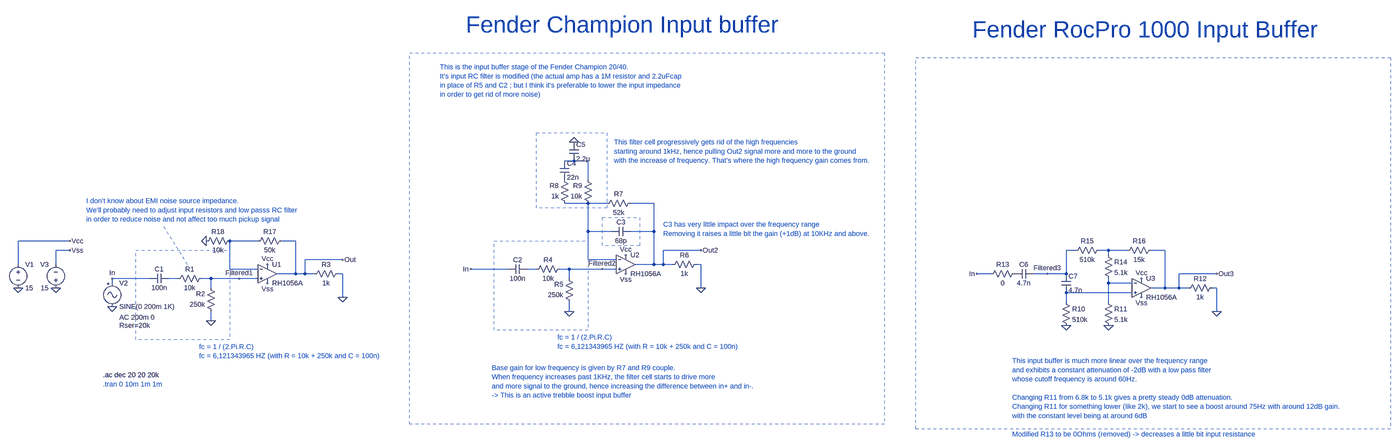
[diagram p0: schematic InputBuffer.asc, whole sheet]
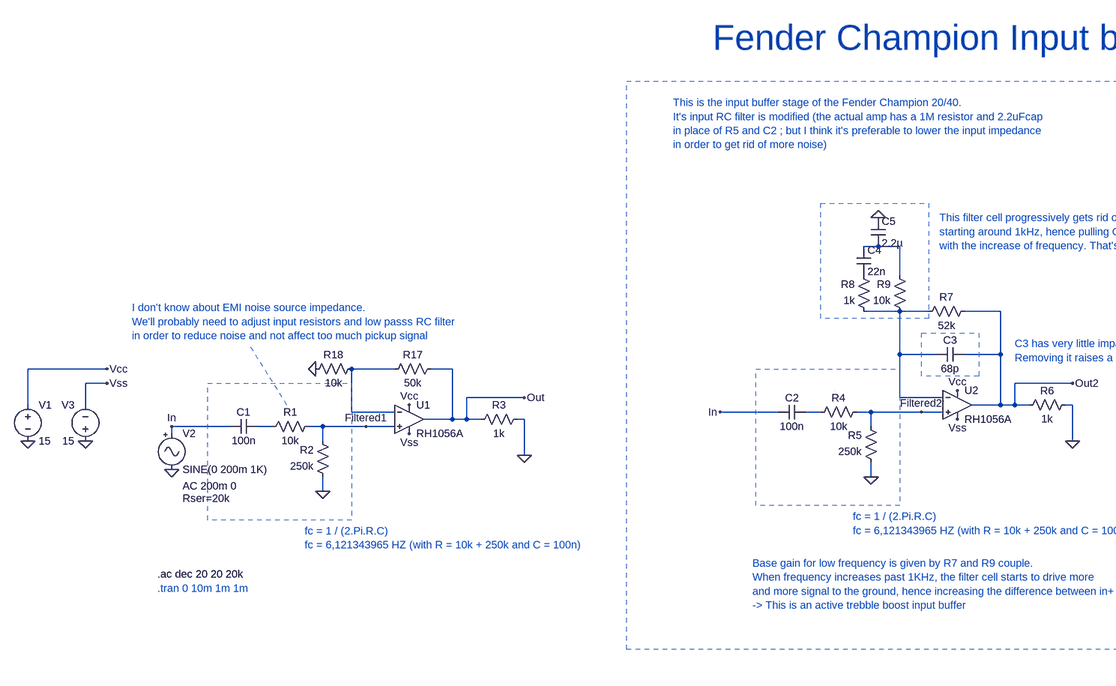
[diagram p1: schematic InputBuffer.asc, part, row 1 of 1, column 1 of 2]
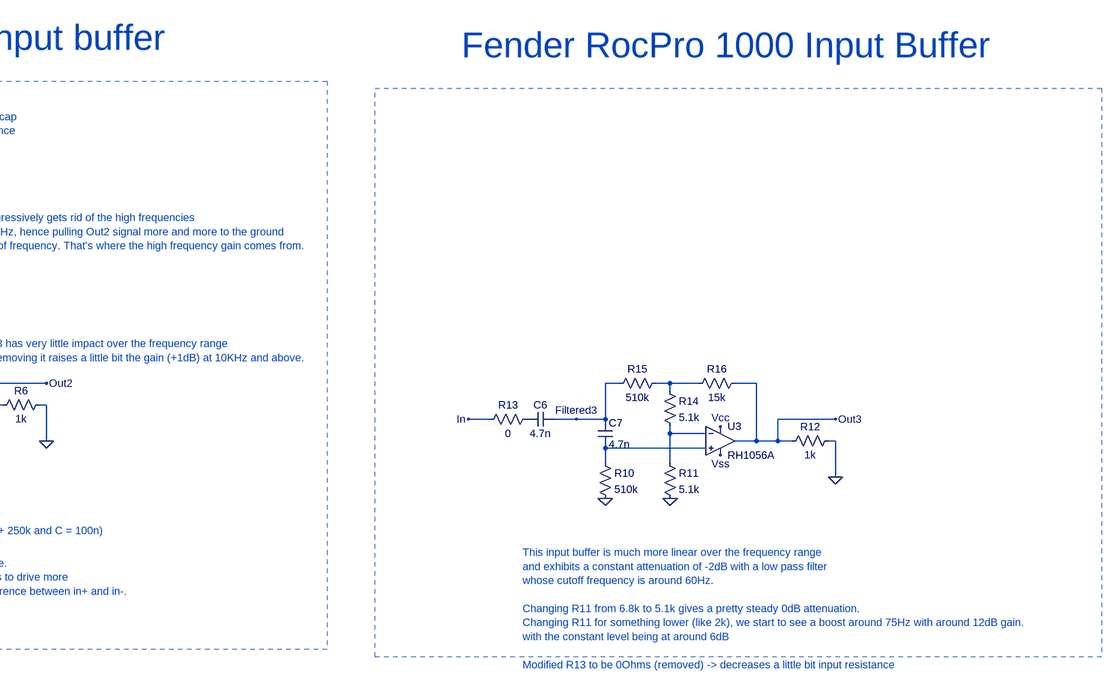
[diagram p2: schematic InputBuffer.asc, part, row 1 of 1, column 2 of 2]
InputBuffer.asc, the LTspice schematic file:
Version 4
SHEET 1 4592 680
WIRE 1440 -304 1408 -304
WIRE 1488 -304 1440 -304
WIRE 1488 -240 1488 -304
WIRE 1488 -160 1408 -160
WIRE 1552 -160 1488 -160
WIRE 1712 -160 1632 -160
WIRE 1488 -64 1488 -160
WIRE 1568 -64 1488 -64
WIRE 1712 -64 1712 -160
WIRE 1712 -64 1632 -64
WIRE -352 -32 -528 -32
WIRE 288 -32 192 -32
WIRE 416 -32 368 -32
WIRE -352 0 -400 0
WIRE 1872 0 1744 0
WIRE 3472 0 3440 0
WIRE 3584 0 3552 0
WIRE 3648 0 3584 0
WIRE 3776 0 3728 0
WIRE 3584 16 3584 0
WIRE 576 32 448 32
WIRE 1488 32 1488 -64
WIRE 1584 32 1488 32
WIRE -528 48 -528 -32
WIRE -400 48 -400 0
WIRE 1712 48 1712 -64
WIRE 1712 48 1648 48
WIRE 1744 48 1744 0
WIRE 1744 48 1712 48
WIRE 1776 48 1744 48
WIRE 1872 48 1856 48
WIRE 192 64 192 -32
WIRE 288 64 192 64
WIRE 1216 64 1088 64
WIRE 1312 64 1280 64
WIRE 1424 64 1392 64
WIRE 1536 64 1424 64
WIRE 1584 64 1536 64
WIRE 416 80 416 -32
WIRE 416 80 352 80
WIRE 448 80 448 32
WIRE 448 80 416 80
WIRE 480 80 448 80
WIRE 576 80 560 80
WIRE 3184 80 3136 80
WIRE 3376 80 3328 80
WIRE 3440 80 3440 0
WIRE 3440 80 3376 80
WIRE 3952 80 3824 80
WIRE -80 96 -208 96
WIRE 16 96 -16 96
WIRE 128 96 96 96
WIRE 224 96 128 96
WIRE 288 96 224 96
WIRE 1424 96 1424 64
WIRE 3440 96 3440 80
WIRE -208 112 -208 96
WIRE 3584 112 3584 96
WIRE 3664 112 3584 112
WIRE 128 128 128 96
WIRE 1872 128 1872 48
WIRE 3776 128 3776 0
WIRE 3776 128 3728 128
WIRE 3824 128 3824 80
WIRE 3824 128 3776 128
WIRE 3856 128 3824 128
WIRE 3952 128 3936 128
WIRE 3664 144 3440 144
WIRE 576 160 576 80
WIRE 3440 176 3440 144
WIRE 3584 176 3584 112
WIRE 1424 208 1424 176
WIRE 3952 208 3952 128
WIRE 128 240 128 208
FLAG -528 128 0
FLAG -400 128 0
FLAG -352 -32 Vcc
FLAG -352 0 Vss
FLAG 320 48 Vcc
FLAG 320 112 Vss
FLAG -208 192 0
FLAG 128 240 0
FLAG 576 160 0
FLAG 576 32 Out
FLAG -208 96 In
FLAG 1616 16 Vcc
FLAG 1616 80 Vss
FLAG 1424 208 0
FLAG 1872 128 0
FLAG 1872 0 Out2
FLAG 1088 64 In
FLAG 1440 -368 0
FLAG 1536 64 Filtered2
FLAG 224 96 Filtered1
FLAG 3696 96 Vcc
FLAG 3696 160 Vss
FLAG 3952 208 0
FLAG 3952 80 Out3
FLAG 3136 80 In
FLAG 3440 256 0
FLAG 3584 256 0
FLAG 3376 80 Filtered3
FLAG 112 -32 0
SYMBOL voltage -528 32 R0
WINDOW 123 0 0 Left 0
WINDOW 39 0 0 Left 0
SYMATTR InstName V1
SYMATTR Value 15
SYMBOL Misc\\signal -208 96 R0
WINDOW 123 24 132 Left 2
WINDOW 39 24 160 Left 2
SYMATTR Value2 AC 200m 0
SYMATTR SpiceLine Rser=20k
SYMATTR InstName V2
SYMATTR Value SINE(0 200m 1K)
SYMBOL voltage -400 144 R180
WINDOW 0 24 96 Left 2
WINDOW 3 24 16 Left 2
WINDOW 123 0 0 Left 0
WINDOW 39 0 0 Left 0
SYMATTR InstName V3
SYMATTR Value 15
SYMBOL cap -16 80 R90
WINDOW 0 0 32 VBottom 2
WINDOW 3 32 32 VTop 2
SYMATTR InstName C1
SYMATTR Value 100n
SYMBOL res 112 80 R90
WINDOW 0 0 56 VBottom 2
WINDOW 3 32 56 VTop 2
SYMATTR InstName R1
SYMATTR Value 10k
SYMBOL res 144 224 R180
WINDOW 0 36 76 Left 2
WINDOW 3 36 40 Left 2
SYMATTR InstName R2
SYMATTR Value 250k
SYMBOL res 576 64 R90
WINDOW 0 0 56 VBottom 2
WINDOW 3 32 56 VTop 2
SYMATTR InstName R3
SYMATTR Value 1k
SYMBOL OpAmps\\RH1056A 320 16 R0
SYMATTR InstName U1
SYMBOL cap 1280 48 R90
WINDOW 0 0 32 VBottom 2
WINDOW 3 32 32 VTop 2
SYMATTR InstName C2
SYMATTR Value 100n
SYMBOL res 1408 48 R90
WINDOW 0 0 56 VBottom 2
WINDOW 3 32 56 VTop 2
SYMATTR InstName R4
SYMATTR Value 10k
SYMBOL res 1440 192 R180
WINDOW 0 36 76 Left 2
WINDOW 3 36 40 Left 2
SYMATTR InstName R5
SYMATTR Value 250k
SYMBOL res 1872 32 R90
WINDOW 0 0 56 VBottom 2
WINDOW 3 32 56 VTop 2
SYMATTR InstName R6
SYMATTR Value 1k
SYMBOL OpAmps\\RH1056A 1616 -16 R0
SYMATTR InstName U2
SYMBOL cap 1632 -80 R90
WINDOW 0 0 32 VBottom 2
WINDOW 3 32 32 VTop 2
SYMATTR InstName C3
SYMATTR Value 68p
SYMBOL res 1648 -176 R90
WINDOW 0 0 56 VBottom 2
WINDOW 3 32 56 VTop 2
SYMATTR InstName R7
SYMATTR Value 52k
SYMBOL res 1424 -144 R180
WINDOW 0 36 76 Left 2
WINDOW 3 36 40 Left 2
SYMATTR InstName R8
SYMATTR Value 1k
SYMBOL res 1504 -144 R180
WINDOW 0 36 76 Left 2
WINDOW 3 36 40 Left 2
SYMATTR InstName R9
SYMATTR Value 10k
SYMBOL cap 1392 -304 R0
SYMATTR InstName C4
SYMATTR Value 22n
SYMBOL cap 1424 -368 R0
SYMATTR InstName C5
SYMATTR Value 2.2µ
SYMBOL cap 3328 64 R90
WINDOW 0 0 32 VBottom 2
WINDOW 3 32 32 VTop 2
SYMATTR InstName C6
SYMATTR Value 4.7n
SYMBOL res 3952 112 R90
WINDOW 0 0 56 VBottom 2
WINDOW 3 32 56 VTop 2
SYMATTR InstName R12
SYMATTR Value 1k
SYMBOL OpAmps\\RH1056A 3696 64 R0
SYMATTR InstName U3
SYMBOL res 3280 64 R90
WINDOW 0 0 56 VBottom 2
WINDOW 3 32 56 VTop 2
SYMATTR InstName R13
SYMATTR Value 0
SYMBOL cap 3424 80 R0
SYMATTR InstName C7
SYMATTR Value 4.7n
SYMBOL res 3424 160 R0
SYMATTR InstName R10
SYMATTR Value 510k
SYMBOL res 3568 160 R0
SYMATTR InstName R11
SYMATTR Value 5.1k
SYMBOL res 3568 0 R0
SYMATTR InstName R14
SYMATTR Value 5.1k
SYMBOL res 3568 -16 R90
WINDOW 0 0 56 VBottom 2
WINDOW 3 32 56 VTop 2
SYMATTR InstName R15
SYMATTR Value 510k
SYMBOL res 3744 -16 R90
WINDOW 0 0 56 VBottom 2
WINDOW 3 32 56 VTop 2
SYMATTR InstName R16
SYMATTR Value 15k
SYMBOL res 384 -48 R90
WINDOW 0 0 56 VBottom 2
WINDOW 3 32 56 VTop 2
SYMATTR InstName R17
SYMATTR Value 50k
SYMBOL res 208 -48 R90
WINDOW 0 0 56 VBottom 2
WINDOW 3 32 56 VTop 2
SYMATTR InstName R18
SYMATTR Value 10k
TEXT -240 424 Left 2 !.ac dec 20 20 20k
TEXT -240 456 Left 2 ;.tran 0 10m 1m 1m
TEXT -296 -168 Left 2 ;I don't know about EMI noise source impedance.\nWe'll probably need to adjust input resistors and low passs RC filter\nin order to reduce noise and not affect too much pickup signal
TEXT 88 328 Left 2 ;fc = 1 / (2.Pi.R.C)\nfc = 6,121343965 HZ (with R = 10k + 250k and C = 100n)
TEXT 1384 296 Left 2 ;fc = 1 / (2.Pi.R.C)\nfc = 6,121343965 HZ (with R = 10k + 250k and C = 100n)
TEXT 984 -624 Left 2 ;This is the input buffer stage of the Fender Champion 20/40.\nIt's input RC filter is modified (the actual amp has a 1M resistor and 2.2uFcap\nin place of R5 and C2 ; but I think it's preferable to lower the input impedance\nin order to get rid of more noise)
TEXT 1744 -88 Left 2 ;C3 has very little impact over the frequency range\nRemoving it raises a little bit the gain (+1dB) at 10KHz and above.
TEXT 1576 -368 Left 2 ;This filter cell progressively gets rid of the high frequencies \nstarting around 1kHz, hence pulling Out2 signal more and more to the ground\nwith the increase of frequency. That's where the high frequency gain comes from.
TEXT 1160 400 Left 2 ;Base gain for low frequency is given by R7 and R9 couple.\nWhen frequency increases past 1KHz, the filter cell starts to drive more\nand more signal to the ground, hence increasing the difference between in+ and in-.\n-> This is an active trebble boost input buffer
TEXT 1072 -768 Left 6 ;Fender Champion Input buffer
TEXT 3120 -752 Left 6 ;Fender RocPro 1000 Input Buffer
TEXT 3256 376 Left 2 ;This input buffer is much more linear over the frequency range\nand exhibits a constant attenuation of -2dB with a low pass filter \nwhose cutoff frequency is around 60Hz.\n \nChanging R11 from 6.8k to 5.1k gives a pretty steady 0dB attenuation.\nChanging R11 for something lower (like 2k), we start to see a boost around 75Hz with around 12dB gain.\nwith the constant level being at around 6dB\n \nModified R13 to be 0Ohms (removed) -> decreases a little bit input resistance
LINE Normal 48 48 -32 -80 2
LINE Normal 48 48 48 48 2
LINE Normal 48 48 48 48 2
LINE Normal 1344 16 1344 16 2
LINE Normal 1344 16 1344 16 2
LINE Normal 3392 32 3392 32 2
LINE Normal 3392 32 3392 32 2
RECTANGLE Normal 192 304 -128 0 2
RECTANGLE Normal 1488 272 1168 -32 2
RECTANGLE Normal 1664 -16 1536 -112 2
RECTANGLE Normal 1552 -144 1312 -400 2
RECTANGLE Normal 2496 592 880 -672 2
RECTANGLE Normal 4544 608 2928 -656 2

The netlist it stands for:
* InputBuffer.asc
V1 Vcc 0 15
V2 In 0 SINE(0 200m 1K) AC 200m 0 Rser=20k
V3 0 Vss 15
C1 N006 In 100n
R1 Filtered1 N006 10k
R2 0 Filtered1 250k
R3 0 Out 1k
XU1 Filtered1 N003 Vcc Vss Out RH1056A  ; pins In+ In- V+ V- OUT
C2 N005 In 100n
R4 Filtered2 N005 10k
R5 0 Filtered2 250k
R6 0 Out2 1k
XU2 Filtered2 N002 Vcc Vss Out2 RH1056A  ; pins In+ In- V+ V- OUT
C3 Out2 N002 68p
R7 Out2 N002 52k
R8 N002 P001 1k
R9 N002 N001 10k
C4 N001 P001 22n
C5 0 N001 2.2µ
C6 Filtered3 P002 4.7n
R12 0 Out3 1k
XU3 N008 N007 Vcc Vss Out3 RH1056A  ; pins In+ In- V+ V- OUT
R13 P002 In 0
C7 Filtered3 N008 4.7n
R10 N008 0 510k
R11 N007 0 5.1k
R14 N004 N007 5.1k
R15 N004 Filtered3 510k
R16 Out3 N004 15k
R17 Out N003 50k
R18 N003 0 10k
.ac dec 20 20 20k
* .tran 0 10m 1m 1m
* I don't know about EMI noise source impedance.
* We'll probably need to adjust input resistors and low passs RC filter
* in order to reduce noise and not affect too much pickup signal
* fc = 1 / (2.Pi.R.C)
* fc = 6,121343965 HZ (with R = 10k + 250k and C = 100n)
* fc = 1 / (2.Pi.R.C)
* fc = 6,121343965 HZ (with R = 10k + 250k and C = 100n)
* This is the input buffer stage of the Fender Champion 20/40.
* It's input RC filter is modified (the actual amp has a 1M resistor and 2.2uFcap
* in place of R5 and C2 ; but I think it's preferable to lower the input impedance
* in order to get rid of more noise)
* C3 has very little impact over the frequency range
* Removing it raises a little bit the gain (+1dB) at 10KHz and above.
* This filter cell progressively gets rid of the high frequencies
* starting around 1kHz, hence pulling Out2 signal more and more to the ground
* with the increase of frequency. That's where the high frequency gain comes from.
* Base gain for low frequency is given by R7 and R9 couple.
* When frequency increases past 1KHz, the filter cell starts to drive more
* and more signal to the ground, hence increasing the difference between in+ and in-.
* -> This is an active trebble boost input buffer
* Fender Champion Input buffer
* Fender RocPro 1000 Input Buffer
* This input buffer is much more linear over the frequency range
* and exhibits a constant attenuation of -2dB with a low pass filter
* whose cutoff frequency is around 60Hz.
* Changing R11 from 6.8k to 5.1k gives a pretty steady 0dB attenuation.
* Changing R11 for something lower (like 2k), we start to see a boost around 75Hz with around 12dB gain.
* with the constant level being at around 6dB
* Modified R13 to be 0Ohms (removed) -> decreases a little bit input resistance
.backanno
.end